# Altium schematic sheet MainBoard.SchDoc
size A4
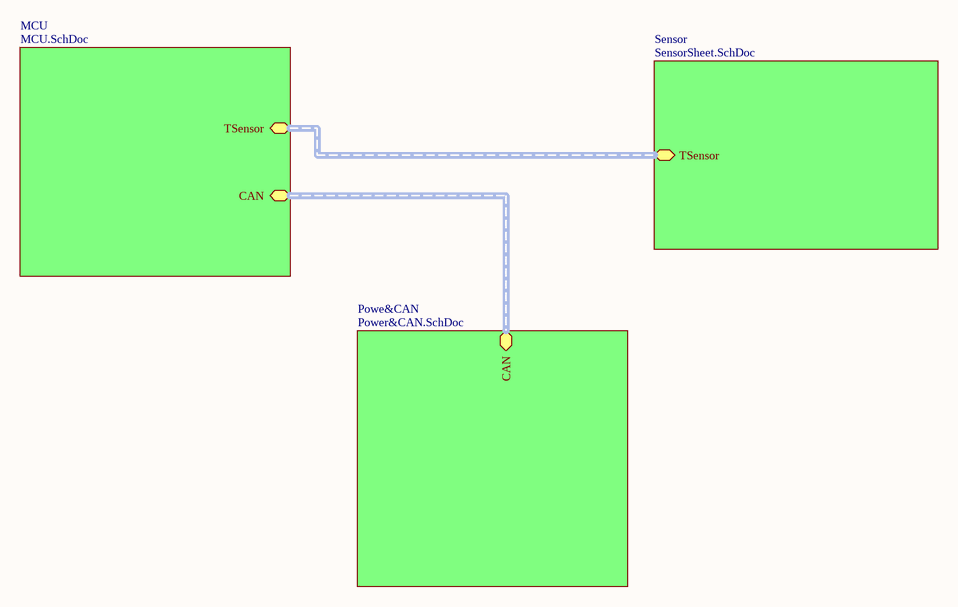
[diagram p0: MainBoard.SchDoc]

## Sub-sheets
MCU = MCU.SchDoc: TSensor, CAN
Powe&CAN = Power&CAN.SchDoc: CAN
Sensor = SensorSheet.SchDoc: TSensor

## Buses and harness runs
harness sheet MCU/CAN = sheet Powe&CAN/CAN
harness sheet MCU/TSensor = sheet Sensor/TSensor